# EAGLE design a3953 (EAGLE 5.10)
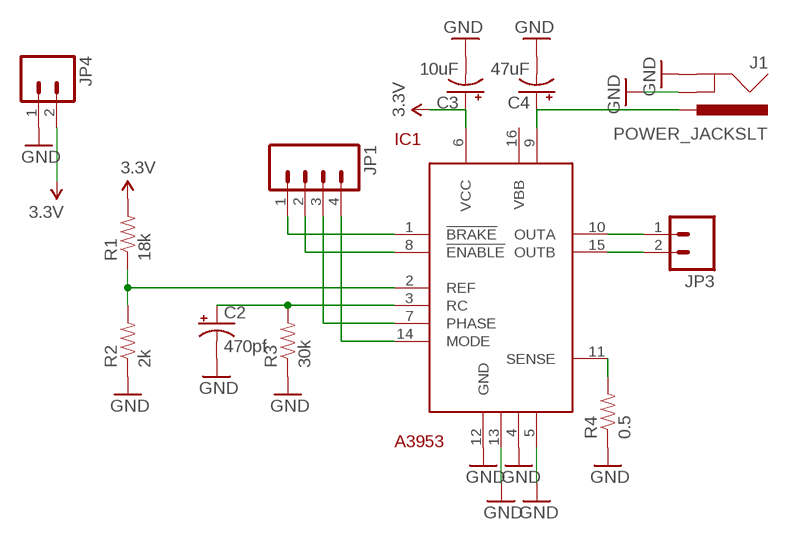
[diagram p0: schematic, sheet 1]

## Parts
C2  470pf  CAP_POLPTH2  [CPOL-RADIAL-10UF-25V]
C3  10uF  CAP_POLPTH2  [CPOL-RADIAL-10UF-25V]
C4  47uF  CAP_POLPTH2  [CPOL-RADIAL-10UF-25V]
IC1  A3953  [DIL16]
J1  POWER_JACKSLT  [POWER_JACK_SLOT]
JP1  M04PTH  [1X04]
JP3  M02_1SPACE  [1X02_SPACE]
JP4  M02PTH  [1X02]
R1  18k  RESISTORPTH1  [AXIAL-0.3]
R2  2k  RESISTORPTH1  [AXIAL-0.3]
R3  30k  RESISTORPTH1  [AXIAL-0.3]
R4  0.5  RESISTORPTH1  [AXIAL-0.3]

## Nets
3.3V: C3.1(+) IC1.6(VCC) JP4.2 R1.P$2
GND: C2.2(-) C3.2(-) C4.2(-) IC1.4(GND1) IC1.5(GND2) IC1.12(GND) IC1.13(GND3) J1.GND@1(GNDBREAK) J1.GND@2(GND) JP4.1 R2.P$1 R3.P$1 R4.P$1
N$1: C4.1(+) IC1.9(VBB2) J1.PWR
N$3: IC1.10(OUTA) JP3.1
N$4: IC1.15(OUTB) JP3.2
N$5: IC1.1(!BRAKE) JP1.1
N$6: IC1.8(!ENABLE) JP1.2
N$7: IC1.7(PHASE) JP1.3
N$8: IC1.14(MODE) JP1.4
N$10: IC1.11(SENSE) R4.P$2
N$12: C2.1(+) IC1.3(RC) R3.P$2
N$13: IC1.2(REF) R1.P$1 R2.P$2

## Power pins joined to a net without a drawn wire
VBB: IC1.16(VBB)

## Library data of the parts
C2-C4 = SparkFun:CAP_POL: Capacitor Polarized These are standard SMD and PTH capacitors. Normally 10uF, 47uF, and 100uF in electrolytic and tantalum varieties. Always verify the external diameter of the through hole cap, it varies with capacity, voltage, and manufacturer. The EIA devices should be standard.
IC1 = 0Robin:A3953
J1 = SparkFun:POWER_JACK: Power Jack This is the standard 5.5mm barrel jack for power. The PTH is the most common, proven, reliable, footprint. All others are experimental. The Slot footprint only works if the mill layer is transmitted to the PCB fab house so be warned. Spark Fun Electronics SKU : PRT-00119. Mating wall wart : TOL-00298 (and others)
JP1 = 0Robin:M04: Header 4 Standard 4-pin 0.1" header. Use with straight break away headers (SKU : PRT-00116), right angle break away headers (PRT-00553), swiss pins (PRT-00743), machine pins (PRT-00117), and female headers (PRT-00115). Molex polarized connector foot print use with SKU : PRT-08231 with associated crimp pins and housings.
JP3 = 0Robin:M02_1SPACE: Header 2 Standard 2-pin 0.1" header. Use with straight break away headers (SKU : PRT-00116), right angle break away headers (PRT-00553), swiss pins (PRT-00743), machine pins (PRT-00117), and female headers (PRT-00115). Molex polarized connector foot print use with SKU : PRT-08233 with associated crimp pins and housings.
JP4 = 0Robin:M02: Header 2 Standard 2-pin 0.1" header. Use with straight break away headers (SKU : PRT-00116), right angle break away headers (PRT-00553), swiss pins (PRT-00743), machine pins (PRT-00117), and female headers (PRT-00115). Molex polarized connector foot print use with SKU : PRT-08233 with associated crimp pins and housings.
R1-R4 = SparkFun:RESISTOR: Resistor Basic schematic elements and footprints for 0603, 1206, and PTH 1/10th watt (small) resistors.

## Board
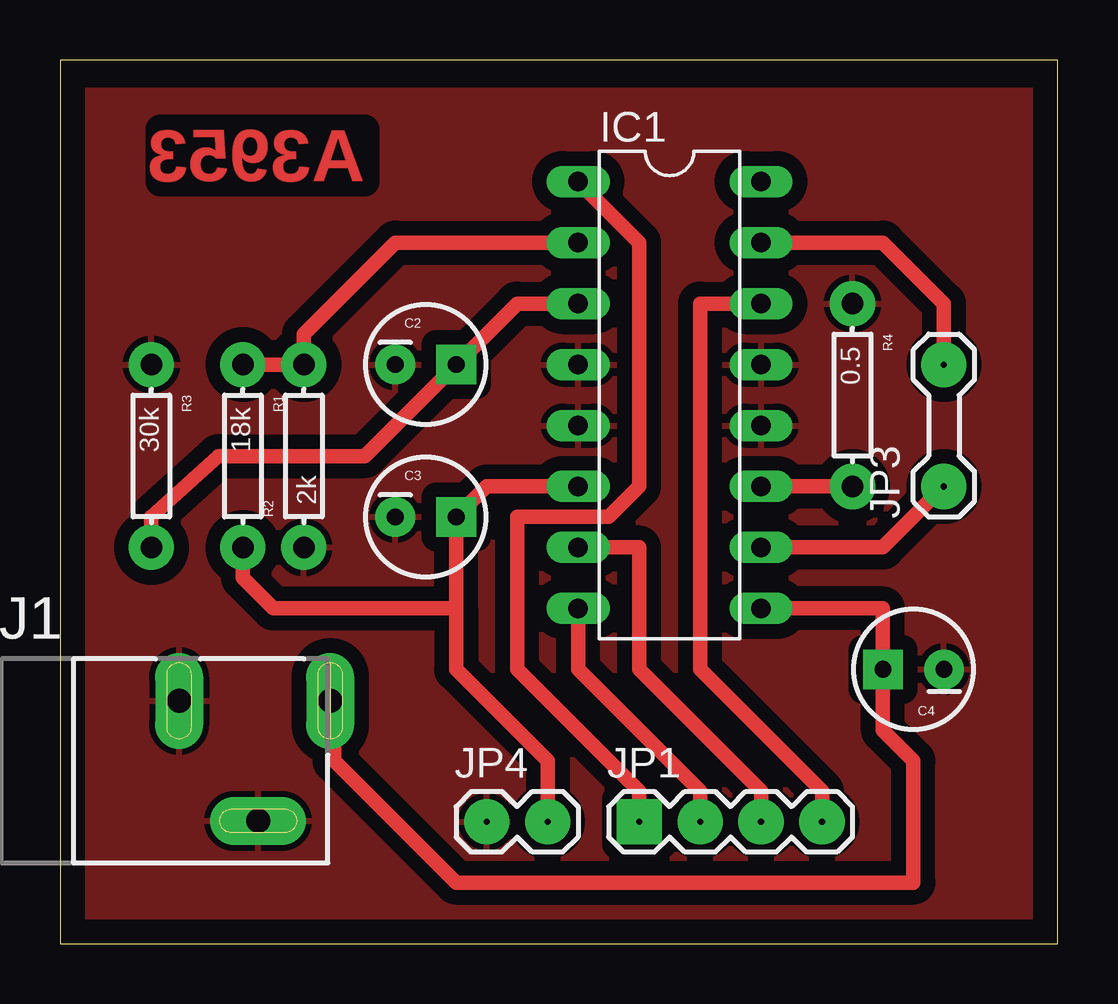
[diagram p1: board, top side]

Size 41.58 x 36.82 mm. Coordinates in mm from the lower left corner, seen from the top.
Outline: 0,0 41.58,0 41.58,36.82 0,36.82 0,0
Copper layers (1*16): Top 0.035mm / dielectric 1.5mm / Bottom 0.035mm
Design rules "default *": minimum track width 24mil, minimum drill 24mil, track to track 8mil, track to pad 8mil, pad to pad 8mil, via to via 8mil, smd to smd 8mil, copper to edge 40mil, drill to drill 8mil, minimum pad ring 10mil, minimum via ring 8mil, stop-mask expansion 4mil, vias tented up to drill 0mil, thermal gap 10mil

### Footprints (pad centres in the part's own frame; a part is rotated, then mirrored left to right if it is on the bottom)
CPOL-RADIAL-10UF-25V = drill 0.7 pad 1.651 square: 1 1.27,0 | drill 0.7 pad 1.651 round: 2 -1.27,0
DIL16 = drill 0.813 long: 1 -8.89,-3.81; 2 -6.35,-3.81; 3 -3.81,-3.81; 4 -1.27,-3.81; 5 1.27,-3.81; 6 3.81,-3.81; 7 6.35,-3.81; 8 8.89,-3.81; 9 8.89,3.81; 10 6.35,3.81; 11 3.81,3.81; 12 1.27,3.81; 13 -1.27,3.81; 14 -3.81,3.81; 15 -6.35,3.81; 16 -8.89,3.81
POWER_JACK_SLOT = drill 1 pad 2 long: GND@1 2.58,7.5; GND@2 7.58,10.8; PWR 2.58,13.8
1X04 = drill 0.254 pad 1.88 square: 1 0,0 | drill 0.254 pad 1.88 round: 2 2.54,0; 3 5.08,0; 4 7.62,0
1X02_SPACE = drill 0.254 pad 1.88 round: 1 -2.54,0; 2 2.54,0
1X02 = drill 0.254 pad 1.88 round: 1 0,0; 2 2.54,0
AXIAL-0.3 = drill 0.9 pad 1.88 round: P$1 -3.81,0; P$2 3.81,0

### Placement (x,y rotation side)
C2  15.24,24.13 0 top
C3  15.24,17.78 0 top
C4  35.56,11.43 180 top
IC1  25.4,22.86 270 top
J1  -2.54,12.7 270 top
JP1  24.13,5.08 0 top
JP3  36.83,21.59 90 top
JP4  17.78,5.08 0 top
R1  7.62,20.32 270 top
R2  10.16,20.32 90 top
R3  3.81,20.32 270 top
R4  33.02,22.86 270 top

### Tracks (layer width: path | path; a pad name or v marks a point on that pad's centre or on a via)
3.3V
  Top 0.61: IC1.6 17.78,19.05 C3.1 16.51,13.97 | 16.51,13.97 16.51,11.43 20.32,7.62 JP4.2 | R1.P$2 7.62,15.24 8.89,13.97 16.51,13.97
GND
  pour Top (isolate 0.61): 0,35.56 40.64,35.56 40.64,0 0,0
N$1
  Top 0.61: IC1.9 34.29,13.97 C4.1 34.29,8.89 35.56,7.62 35.56,2.54 16.51,2.54 11.43,7.62 11.43,8.89 J1.PWR
N$3
  Top 0.61: IC1.10 34.29,16.51 JP3.1
N$4
  Top 0.61: IC1.15 34.29,29.21 36.83,26.67 JP3.2
N$5
  Top 0.61: IC1.1 24.13,29.21 24.13,19.05 22.86,17.78 19.05,17.78 19.05,13.97 19.05,12.7 19.05,11.43 24.13,6.35 JP1.1
N$6
  Top 0.61: IC1.8 21.59,11.43 26.67,6.35 JP1.2
N$7
  Top 0.61: IC1.7 24.13,16.51 24.13,11.43 29.21,6.35 JP1.3
N$8
  Top 0.61: IC1.14 26.67,26.67 26.67,25.4 26.67,15.24 26.67,11.43 31.75,6.35 JP1.4
N$10
  Top 0.61: IC1.11 R4.P$2
N$12
  Top 0.61: IC1.3 19.05,26.67 C2.1 12.7,20.32 6.6,20.32 3.81,17.78 R3.P$2
N$13
  Top 0.61: R1.P$1 R2.P$2 10.16,25.4 13.97,29.21 IC1.2

### Text on the board
Top: A3953